# Altium schematic sheet capacitivetouch.SchDoc: Grove - Capacitive Touch Slider Sensor
size 282 x 378 mm; SheetNumber: 1; Origin: Eagle; GateName_1: G$1; SymbolName_1: SEEEDSTUDIO_SCH_FRAME; LibraryName: moudle; DeviceSetName: SEEEDSTUDIO_SCH_FRAME; Sheet: Sheet:; SeeedStudio: SeeedStudio; Design: Design:; Check: Check:; Vision: Vision:
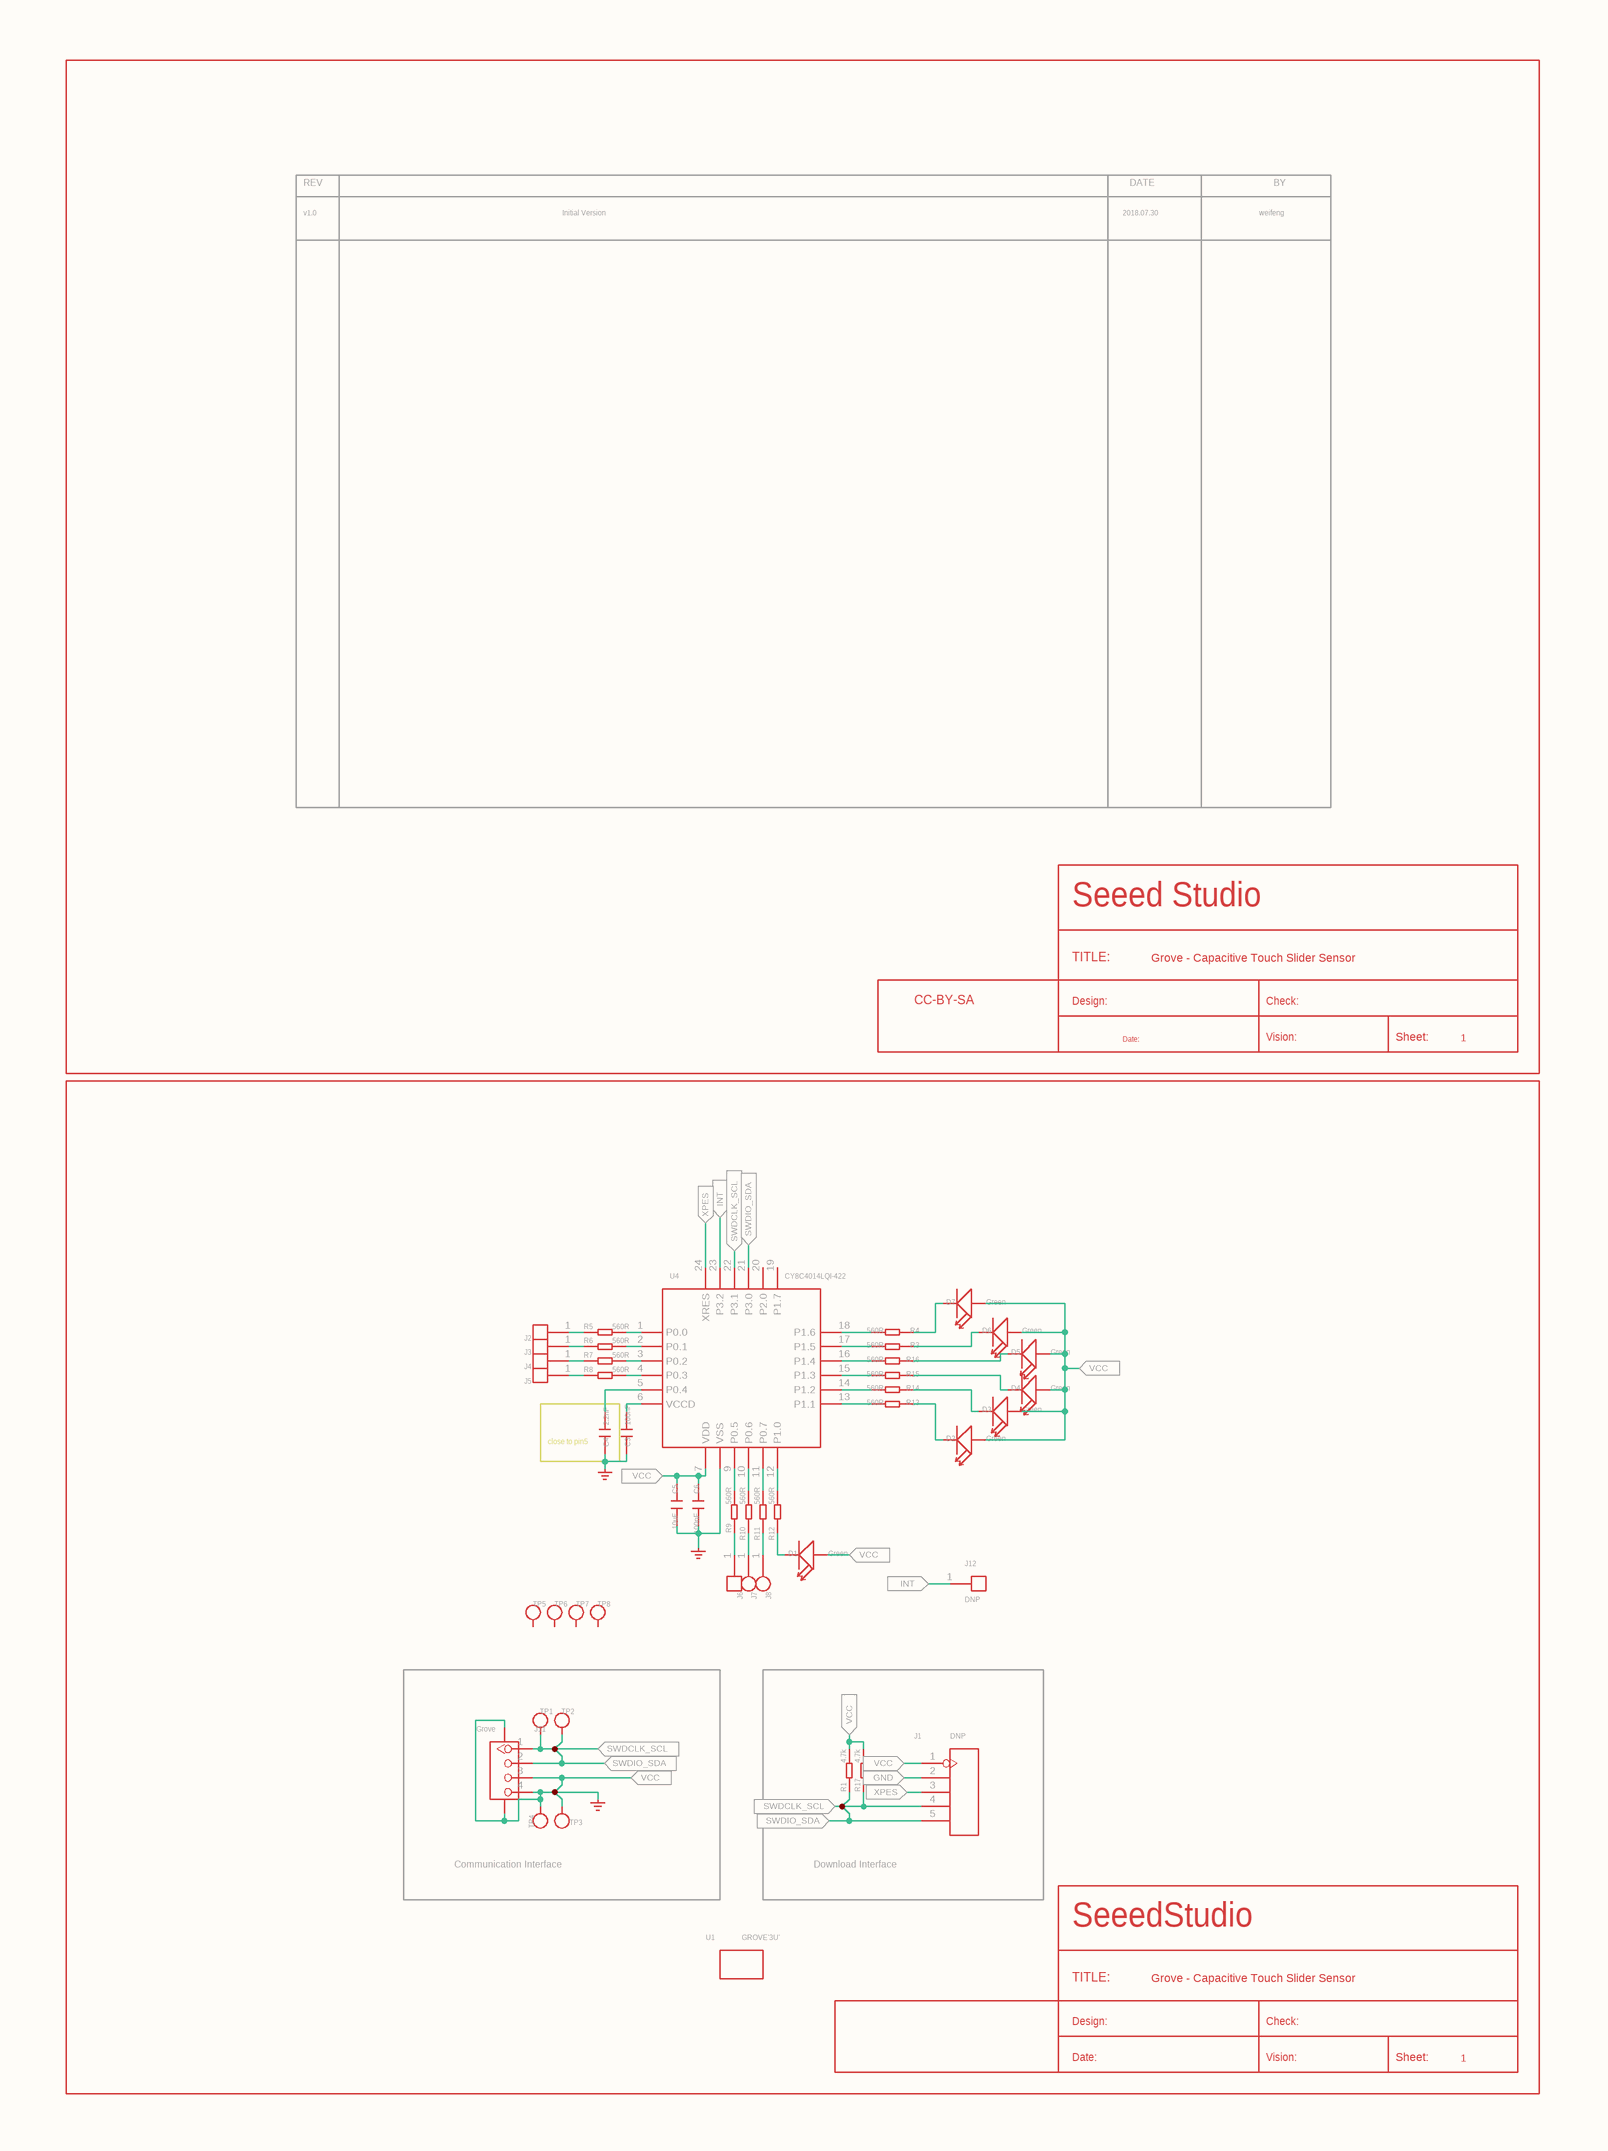
[diagram p0: capacitivetouch.SchDoc]

## Parts
C3  100nF  [C0603]
C4  2.2nF  [C0603]
C5  10uF  [C0603]
C6  100nF  [C0603]
D1  Green  [LED-0603]
D2  Green  [LED-0603]
D3  Green  [LED-0603]
D4  Green  [LED-0603]
D5  Green  [LED-0603]
D6  Green  [LED-0603]
D7  Green  [LED-0603]
FR1  DRAWING_NAME: Grove - Capacitive Touch Slider Sensor  SHEET: 1  Sheet: Sheet:  SeeedStudio: Seeed Studio  TITLE: TITLE:  Design: Design:  Check: Check:  Vision: Vision:  Date: Date:  [SEEEDSTUDIO-PCB-FRAME]  (hidden comment: SEEEDSTUDIO-OPEN-SCH-FRAME)
J1  DNP  [H5-SMD-2.0-TEST]
J2  PAD-SLIDE-1P  [PAD-SLIDE-1P]  (value not drawn)
J3  PAD-SLIDE-1P  [PAD-SLIDE-1P]  (value not drawn)
J4  PAD-SLIDE-1P  [PAD-SLIDE-1P]  (value not drawn)
J5  PAD-SLIDE-1P  [PAD-SLIDE-1P]  (value not drawn)
J6  PAD-SLIDE-1P  [PAD-SLIDE-1P]  (value not drawn)
J7  PAD-SWITCH-1P  [PAD-SWITCH-1P]  (value not drawn)
J8  PAD-SWITCH-1P  [PAD-SWITCH-1P]  (value not drawn)
J11  Grove  [HW4-SMD-2.0-90D]
J12  DNP  [1P-65/35MIL]
R1  4.7k  [R0603]
R3  560R  [R0603]
R4  560R  [R0603]
R5  560R  [R0603]
R6  560R  [R0603]
R7  560R  [R0603]
R8  560R  [R0603]
R9  560R  [R0603]
R10  560R  [R0603]
R11  560R  [R0603]
R12  560R  [R0603]
R13  560R  [R0603]
R14  560R  [R0603]
R15  560R  [R0603]
R16  560R  [R0603]
R17  4.7k  [R0603]
TP1  TEST-POINT'4545'  [TP-D45MIL]  (value not drawn)
TP2  TEST-POINT'4545'  [TP-D45MIL]  (value not drawn)
TP3  TEST-POINT'4545'  [TP-D45MIL]  (value not drawn)
TP4  TEST-POINT'4545'  [TP-D45MIL]  (value not drawn)
TP5  TEST-POINT'4545'  [TP-D45MIL]  (value not drawn)
TP6  TEST-POINT'4545'  [TP-D45MIL]  (value not drawn)
TP7  TEST-POINT'4545'  [TP-D45MIL]  (value not drawn)
TP8  TEST-POINT'4545'  [TP-D45MIL]  (value not drawn)
U1  GROVE'3U'  [GROVE-1*3-DRILL-DIM]
U4  CY8C4014LQI-422  [QFN24G-0.5-4X4MM]
U$1  SEEDSTUDIO-SCH-MODLIST  (value not drawn)
U$6  GND_POWER  (value not drawn)
U$7  GND_POWER  (value not drawn)
U$8  GND_POWER  (value not drawn)

## Blocks framed on the sheet
close to pin5: C4
Communication Interface: J11 TP1-TP4 U$8
Download Interface: J1 R1 R17

## Ports
GND (in), INT (in), SWDCLK_SCL (in), SWDIO_SDA (in), VCC (in), XPES (in)

## Nets
GND: J1.2 ; port GND
INT: J12.1 U4.23(P3.2) ; port INT
SWDCLK_SCL: J1.4 J1.5 J11.1 J11.2 R1.1 R17.1 TP1.T TP2.T U4.21(P3.0) U4.22(P3.1) ; port SWDCLK_SCL, port SWDIO_SDA
VCC: C5.1 C6.1 D1.+ D2.+ D3.+ D4.+ D5.+ D6.+ D7.+ J1.1 J11.3 J11.4 J11.SS1 J11.SS2 R1.2 R17.2 TP3.T TP4.T U4.7(VDD) U$8.?1(GND) ; port VCC
XPES: J1.3 U4.24(XRES) ; port XPES
NetC3_1: C3.1 C4.1 U$6.?1(GND)
NetC3_2: C3.2 U4.6(VCCD)
NetC4_2: C4.2 U4.5(P0.4)
NetC5_2: C5.2 C6.2 U4.8_PAD(VSS) U$7.?1(GND)
NetD1_-: D1.- R12.1
NetD2_-: D2.- R13.1
NetD3_-: D3.- R14.1
NetD4_-: D4.- R15.1
NetD5_-: D5.- R16.1
NetD6_-: D6.- R3.1
NetD7_-: D7.- R4.1
NetJ2_1: J2.1 R5.1
NetJ3_1: J3.1 R6.1
NetJ4_1: J4.1 R7.1
NetJ5_1: J5.1 R8.1
NetJ6_1: J6.1 R9.1
NetJ7_1: J7.1 R10.1
NetJ8_1: J8.1 R11.1
NetR3_2: R3.2 U4.17(P1.5)
NetR4_2: R4.2 U4.18(P1.6)
NetR5_2: R5.2 U4.1(P0.0)
NetR6_2: R6.2 U4.2(P0.1)
NetR7_2: R7.2 U4.3(P0.2)
NetR8_2: R8.2 U4.4(P0.3)
NetR9_2: R9.2 U4.9(P0.5)
NetR10_2: R10.2 U4.10(P0.6)
NetR11_2: R11.2 U4.11(P0.7)
NetR12_2: R12.2 U4.12(P1.0)
NetR13_2: R13.2 U4.13(P1.1)
NetR14_2: R14.2 U4.14(P1.2)
NetR15_2: R15.2 U4.15(P1.3)
NetR16_2: R16.2 U4.16(P1.4)

Not connected (* = marked no-connect by the designer): TP5 T; TP6 T; TP7 T; TP8 T; U4 19(P1.7) 20(P2.0)

## Notes on the sheet
- (near U$1) v1.0
- Initial Version
- 2018.07.30
- weifeng
- SeeedStudio
- TITLE:
- Design:
- Grove - Capacitive Touch Slider Sensor
- Check:
- Date:
- Vision:
- Sheet:
- 1

## Library data of the parts
C3-C6 = CAP-0603: Ceramic Capacitors; GateName_1: C; DeviceName: -0603; DeviceSetName: CAP; SymbolName_1: C; LibraryName: Discrete-new
D1-D7 = LED'0603': GateName_1: LED; DeviceName: '0603'; SymbolName_1: LED; LibraryName: Discrete-new; DeviceSetName: LED
FR1 = SEEEDSTUDIO-OPEN-SCH-FRAME: GateName_1: G$1; SymbolName_1: SEEEDSTUDIO-OPEN-SCH-FRAME; LibraryName: moudle-new; DeviceSetName: SEEEDSTUDIO-OPEN-SCH-FRAME; CC-BY-SA: CC-BY-SA
J1 = HEADER-5P-TEST: GateName_1: G$1; DeviceName: -TEST; SymbolName_1: HEADER-5P; LibraryName: Connector-new; DeviceSetName: HEADER-5P
J2-J6 = PAD-SLIDE-1P: GateName_1: G$1; SymbolName_1: PAD-SLIDE-1P; LibraryName: Connector-new; DeviceSetName: PAD-SLIDE-1P
J7 J8 = PAD-SWITCH-1P: SWITCH PAD; GateName_1: G$1; SymbolName_1: PAD-SWITCH-1P; LibraryName: Connector-new; DeviceSetName: PAD-SWITCH-1P
J11 = GROVE-CONNECTOR-SMD'90D': 4P-SMD-2.0:320110030;4P-SMD-2.0-90D:320110032; GateName_1: G$1; DeviceName: '90D'; SymbolName_1: GROVE-CONNECTOR-SMD; LibraryName: Connector-new; DeviceSetName: GROVE-CONNECTOR-SMD
J12 = HEADER-1P-35: GateName_1: G$1; DeviceName: -35; SymbolName_1: HEADER-1P; LibraryName: Connector-new; DeviceSetName: HEADER-1P
R1 R3-R17 = RES-0603: GateName_1: R; SymbolName_1: RES-ARRAY; DeviceName: -0603; DeviceSetName: RES; LibraryName: Discrete-new
TP1-TP8 = TEST-POINT'4545': PARTNO: DNP; GateName_1: TP; DeviceName: '4545'; SymbolName_1: TEST-POINT; LibraryName: Discrete-new; DeviceSetName: TEST-POINT
U1 = GROVE'3U': GateName_1: G$1; SymbolName_1: GROVE; DeviceName: '3U'; LibraryName: moudle-new; DeviceSetName: GROVE
U4 = MCU-PSOC-4000: GateName_1: G$1; SymbolName_1: MCU-PSOC-4000; LibraryName: IC2-new; DeviceSetName: MCU-PSOC-4000
U$1 = SEEDSTUDIO-SCH-MODLIST: GateName_1: G$1; SymbolName_1: SEEDSTUDIO-SCH-MODLIST; LibraryName: moudle-new; DeviceSetName: SEEDSTUDIO-SCH-MODLIST; REV: REV; DATE: DATE; BY: BY
U$6-U$8 = GND_POWER: GateName_1: G$1; SymbolName_1: GND_POWER; LibraryName: Power or GND; DeviceSetName: GND_POWER